# EasyEDA Pro project BioWatch_PCB-DESKTOP-TT52GDR.eprj, board PCB_4
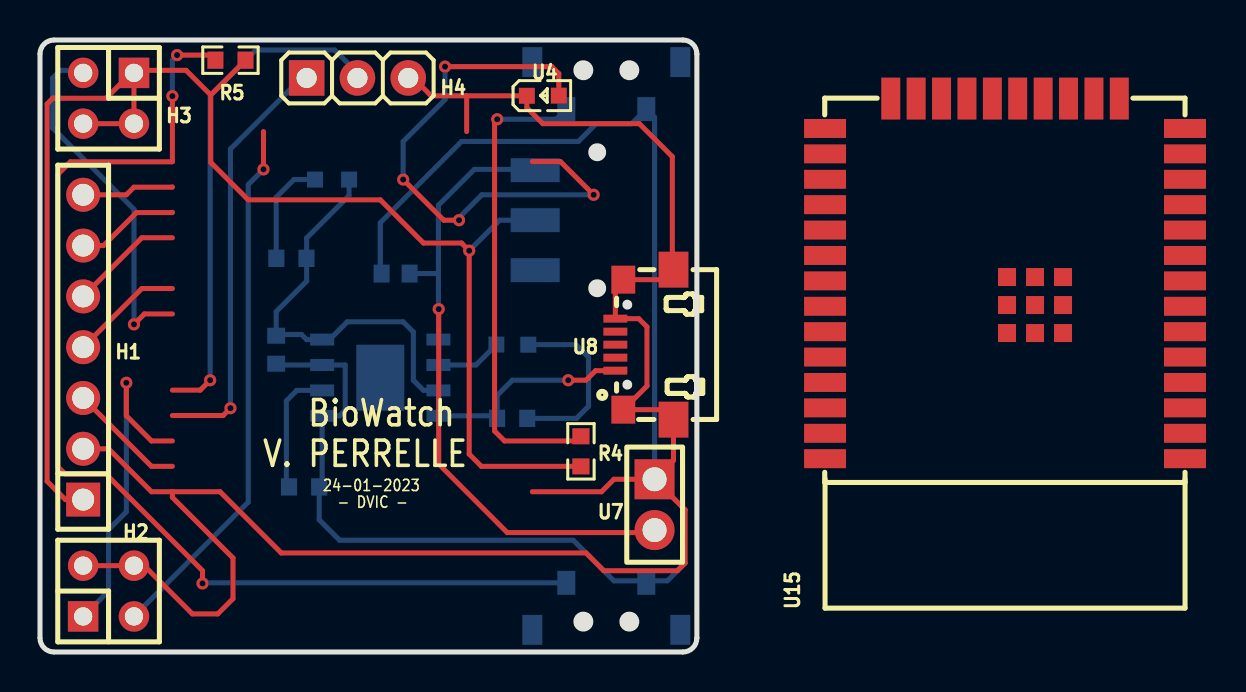
[diagram p9: board, top side]
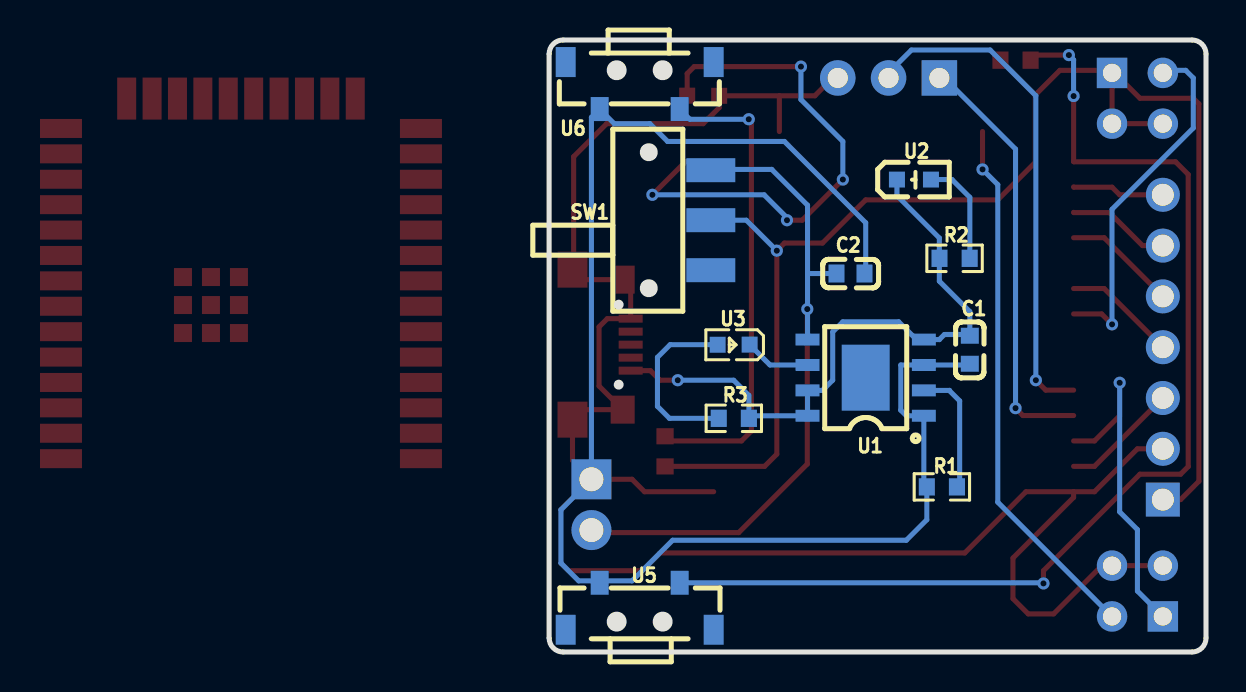
[diagram p10: board, bottom side, seen from below]

Outline 32.85 x 30.6 mm; copper layers: Top Layer, Bottom Layer. Coordinates in mm from the lower left corner of the outline.
Outline path: 0,29.9 0,0.7 arc(0.21,0.21) 0.7,0 32.15,0 arc(32.64,0.21) 32.85,0.7 32.85,29.9 arc(32.64,30.39) 32.15,30.6 0.7,30.6 arc(0.21,30.39) 0,29.9
Stack: Top Layer 0.035mm / Dielectric1 1.51mm FR4 er 4.5 / Bottom Layer 0.035mm

## Design rules (mm)
spacing Default (default): track to track 0.152, other pairs 0 to 0.254
track width Default (default): min 0.254, default 0.254, max 25.4
differential pair differentialPair (default): width min 0.127, default 0.254, max 2.54; gap min 0.152, default 0.152
via Default (default): diameter min 0.61, default 0.61, max 100.025; hole min 0.305, default 0.305, max 59.995

## Placement (name value [footprint] x y rotation side)
C1  CAPCER0.1UF16VX5R0603,CAPCER0.1UF25VX5R0603,CAPCER0.1UF16VX7R0603  [C0603]  11.81 15.11 90 bottom
C2  10uF  [C0603]  17.78 18.92 0 bottom
H1  PZ254V-11-07P  [HDR-TH_7P-P2.54-V-M]  2.16 15.24 90 top
H2  B-2100S04P-B110  [HDR-TH_4P-P2.54-V-M-R2-C2-S2.54-1]  3.43 3.05 0 top
H3  B-2100S04P-B110  [HDR-TH_4P-P2.54-V-M-R2-C2-S2.54-1]  3.43 27.69 180 top
H4  H7: header 1x3 programmation serial  [HEADER3L]  13.33 28.7 0 top
R1  1.2kΩ  [R0603]  13.21 8.26 180 bottom
R2  1kΩ  [R0603]  12.57 19.69 0 bottom
R3  1kΩ  [R0603]  23.61 11.68 180 bottom
R4  10kΩ  [R0603]  27.05 10.03 270 top
R5  10kΩ  [R0603]  9.52 29.59 180 top
SW1  TA-3525-A3  [SW-SMD_3P-L9.1-W3.5-P2.50-EH6.8]  24.76 21.59 270 bottom
U1  TP4056_C382139  [ESOP-8_L4.9-W3.9-P1.27-LS6.0-BL-EP]  17.02 13.72 90 bottom
U2  LED0603R  [LED0603-R-RD]  14.6 23.62 180 bottom
U3  LED0603B  [LED0603-RD]  23.62 15.37 0 bottom
U4  LED0603B  [LED0603-RD]  25.15 27.81 0 top
U5  BUTTON1  [SW-SMD_L7.8-W3.5-P4.00-EH]  28.32 2.29 0 bottom
U6  BUTTON2  [SW-SMD_L7.8-W3.5-P4.00-EH]  28.32 28.32 180 bottom
U7  DM254R-11-02-85  [HDR-TH_2P-P2.54-V-F]  30.73 7.37 270 top
U8  USB-MICRO-5P  [MICRO-USB-SMD_MICRO-USB-A9]  30.23 15.37 90 top
U15  ESP32-WROOM-32E-H4  [WIFI-SMD_ESP32-WROOM-32E]  48.26 18.67 90 top

## Footprints (pads in the part's own frame, mm; a bottom-side part is the same pattern mirrored in y, then rotated)
C0603
  rect 0.8x0.9 smd: 1(-0.7,0) 2(0.7,0)
ESOP-8_L4.9-W3.9-P1.27-LS6.0-BL-EP
  rect 0.6x1.2 smd: 1(-1.905,-2.909) 2(-0.635,-2.909) 3(0.635,-2.909) 4(1.905,-2.909) 5(1.905,2.909) 6(0.635,2.909) 7(-0.635,2.909) 8(-1.905,2.909)
  rect 3.3x2.4 smd: 9(0,0)
HDR-TH_2P-P2.54-V-F
  rect 2x2 hole 1.2: 1(-1.27,0)
  round 2 hole 1.2: 2(1.27,0)
HDR-TH_4P-P2.54-V-M-R2-C2-S2.54-1
  rect 1.524x1.524 hole 0.914: 1(-1.27,-1.27)
  round 1.524 hole 0.914: 2(-1.27,1.27) 3(1.27,-1.27) 4(1.27,1.27)
HDR-TH_7P-P2.54-V-M
  rect 1.7x1.7 hole 1.1: 1(-7.62,0)
  round 1.7 hole 1.1: 2(-5.08,0) 3(-2.54,0) 4(0,0) 5(2.54,0) 6(5.08,0) 7(7.62,0)
HEADER3L
  rect 1.778x1.778 hole 1.005x1: 1(0,0)
  round 1.778 hole 1.005x1: 2(2.54,0) 3(5.08,0)
LED0603-R-RD
  rect 0.8x0.8 smd: 1(0.851,0) 2(-0.851,0)
LED0603-RD
  rect 0.8x0.8 smd: 1(-0.799,-0.004) 2(0.799,0.004)
MICRO-USB-SMD_MICRO-USB-A9
  rect 0.4x1.2 smd: 1(-1.3,1.455) 2(-0.65,1.455) 3(0,1.455) 4(0.65,1.455) 5(1.3,1.455)
  rect 1.4x1.2 smd: 6(3.25,1.055) 7(-3.25,1.055)
  rect 1.8x1.5 smd: 8(-3.75,-1.455) 9(3.75,-1.455)
R0603
  rect 0.806x0.864 smd: 1(-0.753,0) 2(0.753,0)
SW-SMD_3P-L9.1-W3.5-P2.50-EH6.8
  rect 1.2x2.45 smd: 1(-2.5,0) 2(0,0) 3(2.5,0)
SW-SMD_L7.8-W3.5-P4.00-EH
  rect 0.9x1.2 smd: 1(-2,-1.175) 2(2,-1.175)
  rect 1x1.5 smd: 3(-3.7,1.175) 4(3.7,1.175)
WIFI-SMD_ESP32-WROOM-32E
  rect 0.95x2.1 smd: 1(-9.002,-9) 2(-7.732,-9) 3(-6.463,-9) 4(-5.192,-9) 5(-3.922,-9) 6(-2.652,-9) 7(-1.383,-9) 8(-0.113,-9) 9(1.157,-9) 10(2.428,-9) 11(3.697,-9) 12(4.968,-9) 13(6.237,-9) 14(7.508,-9) 25(7.508,9) 26(6.237,9) 27(4.968,9) 28(3.697,9) 29(2.428,9) 30(1.157,9) 31(-0.113,9) 32(-1.383,9) 33(-2.652,9) 34(-3.922,9) 35(-5.192,9) 36(-6.463,9) 37(-7.732,9) 38(-9.002,9)
  rect 2.1x0.95 smd: 15(9.002,-5.715) 16(9.002,-4.445) 17(9.002,-3.175) 18(9.002,-1.905) 19(9.002,-0.635) 20(9.002,0.635) 21(9.002,1.905) 22(9.002,3.175) 23(9.002,4.445) 24(9.002,5.715)
  rect 0.9x0.9 smd: 39(-2.721,-0.1) 39(-2.721,-1.5) 39(-2.721,-2.9) 39(-1.321,-0.1) 39(-1.321,-1.5) 39(-1.321,-2.9) 39(0.079,-0.1) 39(0.079,-1.5) 39(0.079,-2.9)

## Nets
As in the schematic.

Pads without a net: H1 3; SW1 3; U1 9; U5 3 4; U6 3 4; U8 2 3 4; U15 1 2 3 4 5 6 7 8 9 10 11 12 13 14 15 16 17 18 19 20 21 22 23 24 25 26 27 28 29 30 31 32 33 34 35 36 37 38 39

## Via types
v1: diameter 0.61, hole 0.305, Top Layer to Bottom Layer, 16 vias

## Routing (per net, layer and track width the routed paths; a pad name or vN(x,y) marks a point on that pad's centre or on a via; arc(x,y) is an arc through that point)
+5V: length 32.5
  Top Layer w0.254: v1(26.42,13.59) 27.3,13.59 27.78,14.07 U8.1
  Bottom Layer w0.254: v1(26.42,13.59) 23.62,13.59 22.86,12.83 R3.2 22.73,11.81 U1.8 U1.7 19.18,13.08 18.67,13.59 18.67,16 18.16,16.51 15.37,16.51 14.48,15.62 U1.4 13.33,15.62 13.08,15.88 12.09,15.88 11.87,15.81 ; U2.2 15.46,22.82 13.33,20.7 13.33,18.54 11.81,17.02 C1.2
GND: length 173.5
  Top Layer w0.254: 30.73,8.64 31.68,9.58 U8.8 31.18,12.12 U8.7 30.35,13.3 30.35,16.26 29.94,16.67 U8.5 28.77,18.22 U8.6 31.18,18.62 U8.9 31.62,19.18 31.62,24.77 29.97,26.42 25.15,26.42 24.35,27.22 U4.1 21.34,27.81 ; 30.73,8.64 28.7,8.64 28.08,8.01 24.62,8.01 ; 30.73,8.64 32.26,7.11 32.26,4.45 31.88,4.06 28.19,4.06 27.3,4.95 12.06,4.95 9,8.01 6.62,8.01 ; 21.34,27.81 19.56,27.81 18.41,28.96 ; 21.34,27.81 21.34,26.02 ; 6.62,8.01 6.62,7.73 9.65,4.7 9.65,2.67 8.89,1.91 7.62,1.91 5.21,4.32 H2.4 H2.2 ; 6.62,8.01 5.58,8.01 3.43,10.16 H1.2
  Bottom Layer w0.254: 16.95,18.92 17.02,18.99 17.02,21.46 21.08,25.53 26.92,25.53 27.81,26.42 29.59,26.42 U6.1 30.73,26.73 30.73,8.64 32.26,7.11 32.26,4.45 31.37,3.56 30.42,3.56 U5.2 30.23,3.56 28.7,3.56 26.67,5.59 14.99,5.59 13.96,6.61 R1.1 14.1,8.26 14.11,8.27 U1.1 14.99,11.81 15.26,12.09 15.26,14.35 U1.3 11.87,14.35 C1.1
VCC: length 76.1
  Top Layer w0.254: 8.54,27.85 8.54,24.48 10.41,22.61 17.02,22.61 19.18,20.45 21.08,20.45 v1(21.46,20.07) 21.46,9.89 22.07,9.28 27.05,9.28 R4.2 ; 8.54,27.85 7.31,29.08 4.7,29.08 3.3,27.69 0.63,27.69 0.36,27.41 0.36,8.53 1.27,7.62 H1.1 ; 8.54,27.85 R5.1 ; H3.4 H3.2 H3.1
  Bottom Layer w0.254: v1(21.46,20.07) 22.99,21.59 SW1.2
BAT+: length 33.8
  Top Layer w0.254: U7.2 30.61,5.97 23.37,5.97 19.94,9.4 v1(19.94,17.15)
  Bottom Layer w0.254: SW1.1 24.72,24.13 21.72,24.13 19.93,22.34 19.93,18.92 ; 19.93,18.92 C2.2 ; 19.93,18.92 U1.5
$2N3160: length 6.4
  Bottom Layer w0.254: U1.2 12.83,13.08 12.83,13.06 12.32,12.56 12.32,8.38 12.45,8.26 R1.2
$2N3161: length 9
  Bottom Layer w0.254: U3.2 24.42,15.37 26.8,15.37 27.43,14.73 27.43,12.28 26.83,11.68 R3.1
$2N3167: length 5.4
  Bottom Layer w0.254: U2.1 12.7,23.62 11.81,22.73 11.81,19.69 R2.1
$2N3169: length 3.3
  Bottom Layer w0.254: U3.1 21.8,14.35 U1.6
$2N3176: length 5.7
  Top Layer w0.254: H1.5 5.09,20.71 6.62,20.71
$2N3180: length 21.4
  Top Layer w0.254: 6.62,11.82 9.16,11.82 v1(9.52,12.19)
  Bottom Layer w0.254: v1(9.52,12.19) 9.52,25.15 13.33,28.96
$2N3181: length 25.1
  Top Layer w0.254: 6.62,13.09 8.01,13.09 v1(8.51,13.59)
  Bottom Layer w0.254: v1(8.51,13.59) 8.51,27.81 10.79,30.1 14.73,30.1 15.88,28.96
$2N3182: length 5.9
  Top Layer w0.254: 6.62,9.28 5.58,9.28 2.16,12.7
$2N3183: length 5.2
  Top Layer w0.254: 6.62,21.98 6.61,21.97 4.83,21.97 3.17,20.32 H1.6
$2N3191: length 23.9
  Top Layer w0.254: v1(22.87,26.64) 22.73,26.5 22.73,11.05 23.23,10.55 26.82,10.55 R4.1
  Bottom Layer w0.254: v1(22.87,26.64) 25.81,26.64 U6.2
$2N3194: length 56.3
  Top Layer w0.254: v1(6.86,29.84) 8.52,29.84 R5.2 ; 6.6,27.81 v1(6.62,27.8) 6.62,24.52 6.62,24.52 6.6,24.51 1.52,24.51 0.89,23.88 0.89,9.27 1.27,8.89 3.3,8.89 8.13,4.06 v1(8.13,3.43)
  Bottom Layer w0.254: v1(6.62,27.8) 6.62,29.61 v1(6.86,29.84) ; v1(8.13,3.43) 8.16,3.46 U5.1
$2N4020: length 26.9
  Top Layer w0.254: v1(11.18,24.13) 11.18,26.02
  Bottom Layer w0.254: v1(11.18,24.13) 10.41,23.37 10.41,7.49 H2.3
$2N4222: length 17.8
  Top Layer w0.254: v1(4.7,16.38) 5.22,16.9 6.62,16.9
  Bottom Layer w0.254: v1(4.7,16.38) 4.7,22.13 0.63,26.2 0.63,28.7 1.02,29.08 2.16,29.08
$2N4223: length 4.6
  Top Layer w0.254: H1.7 4.32,22.86 4.7,23.24 6.61,23.24 6.62,23.25
$2N4430: length 17.1
  Top Layer w0.254: v1(4.32,13.46) 4.32,11.81 5.58,10.55 6.62,10.55
  Bottom Layer w0.254: v1(4.32,13.46) 4.32,7.01 3.43,6.12 3.43,3.05 2.16,1.78
$2N6627: length 28.2
  Top Layer w0.254: v1(20.95,21.59) 20.19,21.59 v1(18.16,23.62) ; U4.2 25.95,28.92 25.6,29.27 v1(20.26,29.27) ; 24.62,24.52 26.02,24.52 v1(27.69,22.86)
  Bottom Layer w0.254: v1(20.26,29.27) 20.26,27.62 18.16,25.53 v1(18.16,23.62) ; v1(20.95,21.59) 20.95,21.72 22.1,22.86 v1(27.69,22.86)
$2N14901: length 5.7
  Top Layer w0.254: H1.4 5.09,18.17 6.62,18.17

## Text on the board
Top Silkscreen Layer: 24-01-2023 | - DVIC - | BioWatch / V. PERRELLE
